# Altium schematic sheet 1A20J1_1A21J2 B.SchDoc: Cable Assembly
size A; Date: 1/1/17; CompanyName: National Center for Atmospheric Research; DrawnBy: Rich Erickson; Engineer: 4/21/17; Organization: Earth Observing Laboratory; Address1: 3450 Mitchell Lane; Address2: FL1; Address3: 3090 Center Green Dr.; Address4: Boulder, CO. 80301; DocumentNumber: 1A20J1_1A21J2; Revision: B; SheetNumber: 1; SheetTotal: 1; Department: Remote Sensing Facility; ModifiedDate: 7/17/97; ImagePath: 4/21/17; ProjectName: Ka Band; Application_BuildNumber: 5
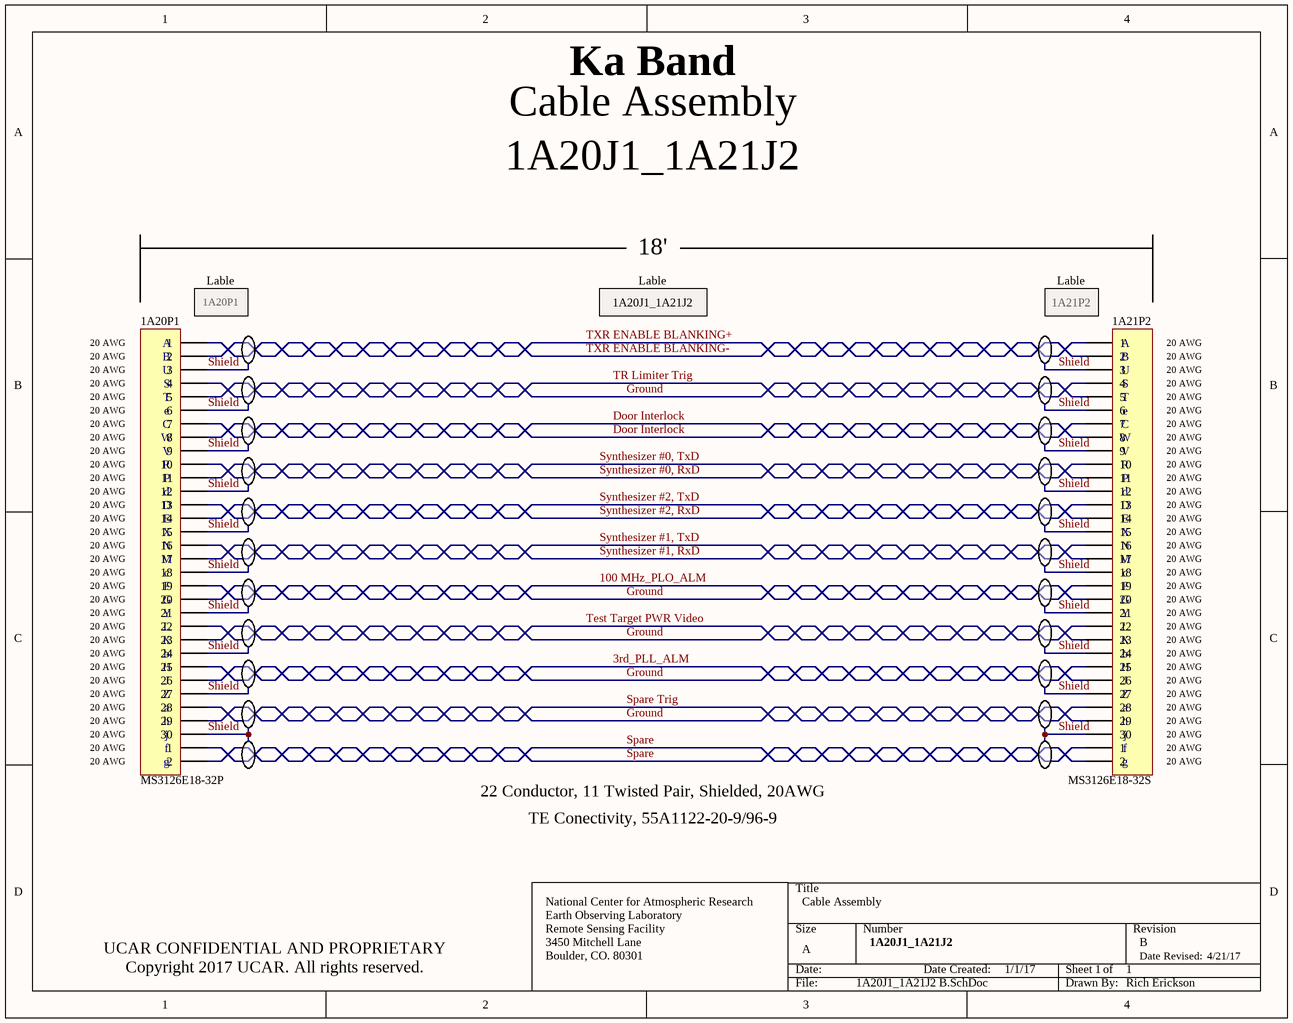
[diagram p0: 1A20J1_1A21J2 B.SchDoc]

## Parts
1A20P1  MS3126E18-32P  [HDR1X30]  (value not drawn)
1A20P1a  MS3126E18-32P  [HDR1X2]
1A21P2  MS3126E18-32S  [HDR1X30]  (value not drawn)
1A21P2a  MS3126E18-32S  [HDR1X2]

## Nets
3rd_PLL_ALM: 1A20P1.25 1A21P2.25
100 MHz_PLO_ALM: 1A20P1.19 1A21P2.19
Door Interlock: 1A20P1.7 1A20P1.8 1A21P2.7 1A21P2.8
Ground: 1A20P1.5 1A20P1.20 1A20P1.23 1A20P1.26 1A20P1.29 1A21P2.5 1A21P2.20 1A21P2.23 1A21P2.26 1A21P2.29
Shield: 1A20P1.3 1A20P1.6 1A20P1.9 1A20P1.12 1A20P1.15 1A20P1.18 1A20P1.21 1A20P1.24 1A20P1.27 1A20P1.30 1A21P2.3 1A21P2.6 1A21P2.9 1A21P2.12 1A21P2.15 1A21P2.18 1A21P2.21 1A21P2.24 1A21P2.27 1A21P2.30
Spare: 1A20P1a.1 1A20P1a.2 1A21P2a.1 1A21P2a.2
Spare Trig: 1A20P1.28 1A21P2.28
Synthesizer #0, RxD: 1A20P1.11 1A21P2.11
Synthesizer #0, TxD: 1A20P1.10 1A21P2.10
Synthesizer #1, RxD: 1A20P1.17 1A21P2.17
Synthesizer #1, TxD: 1A20P1.16 1A21P2.16
Synthesizer #2, RxD: 1A20P1.14 1A21P2.14
Synthesizer #2, TxD: 1A20P1.13 1A21P2.13
Test Target PWR Video: 1A20P1.22 1A21P2.22
TR Limiter Trig: 1A20P1.4 1A21P2.4
TXR ENABLE BLANKING+: 1A20P1.1 1A21P2.1
TXR ENABLE BLANKING-: 1A20P1.2 1A21P2.2

## Notes on the sheet
- (near 1A20P1) 1A20P1
- Lable
- 18'
- 1A20J1_1A21J2
- (near 1A21P2) 1A21P2
- 20 AWG
- (near 1A20P1) A
- (near 1A20P1) B
- (near 1A20P1) U
- (near 1A21P2) A
- (near 1A21P2) B
- (near 1A21P2) U
- (near 1A20P1) C
- (near 1A20P1) S
- (near 1A20P1) T
- (near 1A20P1) W
- (near 1A20P1) e
- (near 1A21P2) C
- (near 1A21P2) S
- (near 1A21P2) T
- (near 1A21P2) W
- (near 1A21P2) e
- (near 1A20P1) D
- (near 1A20P1) P
- (near 1A20P1) R
- (near 1A20P1) V
- (near 1A20P1) d
- (near 1A21P2) D
- (near 1A21P2) P
- (near 1A21P2) R
- (near 1A21P2) V
- (near 1A21P2) d
- (near 1A20P1) E
- (near 1A20P1) M
- (near 1A20P1) N
- (near 1A20P1) X
- (near 1A20P1) c
- (near 1A21P2) E
- (near 1A21P2) M
- (near 1A21P2) N
- (near 1A21P2) X
- (near 1A21P2) c
- (near 1A20P1) F
- (near 1A20P1) G
- (near 1A20P1) K
- (near 1A20P1) L
- (near 1A20P1) Y
- (near 1A21P2) F
- (near 1A21P2) G
- (near 1A21P2) K
- (near 1A21P2) L
- (near 1A21P2) Y
- (near 1A20P1) H
- (near 1A20P1) J
- (near 1A20P1) Z
- (near 1A20P1) a
- (near 1A20P1) b
- (near 1A21P2) H
- (near 1A21P2) J
- (near 1A21P2) Z
- (near 1A21P2) a
- (near 1A21P2) b
- f
- (near 1A20P1a) g
- (near 1A20P1) h
- j
- (near 1A21P2a) g
- (near 1A21P2) h
- 22 Conductor, 11 Twisted Pair, Shielded, 20AWG
- TE Conectivity, 55A1122-20-9/96-9
- UCAR CONFIDENTIAL AND PROPRIETARY
  Copyright 2017 UCAR. All rights reserved.
- Date Created:
- Date Revised:

## Library data of the parts
1A20P1 1A21P2 = Header 30: Header, 30-Pin; LatestRevisionDate: 17-Jul-2002; LatestRevisionNote: Re-released for DXP Platform.; Publisher: Altium Limited
1A20P1a 1A21P2a = Header 2: Header, 2-Pin; LatestRevisionDate: 17-Jul-2002; LatestRevisionNote: Re-released for DXP Platform.; Publisher: Altium Limited